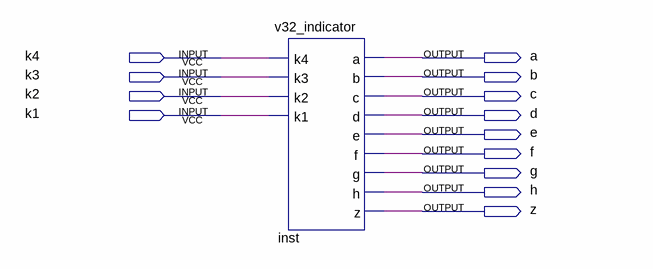
[diagram p0: schematic sheet]
// Quartus schematic s32_indic.bdf as structural Verilog: 1 symbols, 13 pins
module s32_indic (
  input  k4,
  input  k3,
  input  k2,
  input  k1,
  output a,
  output b,
  output c,
  output d,
  output e,
  output f,
  output g,
  output h,
  output z
);

  v32_indicator inst (
    .k4(k4), .k3(k3), .k2(k2), .k1(k1), .a(a), .b(b), .c(c), .d(d), .e(e), .f(f), .g(g), .h(h), .z(z));
endmodule
